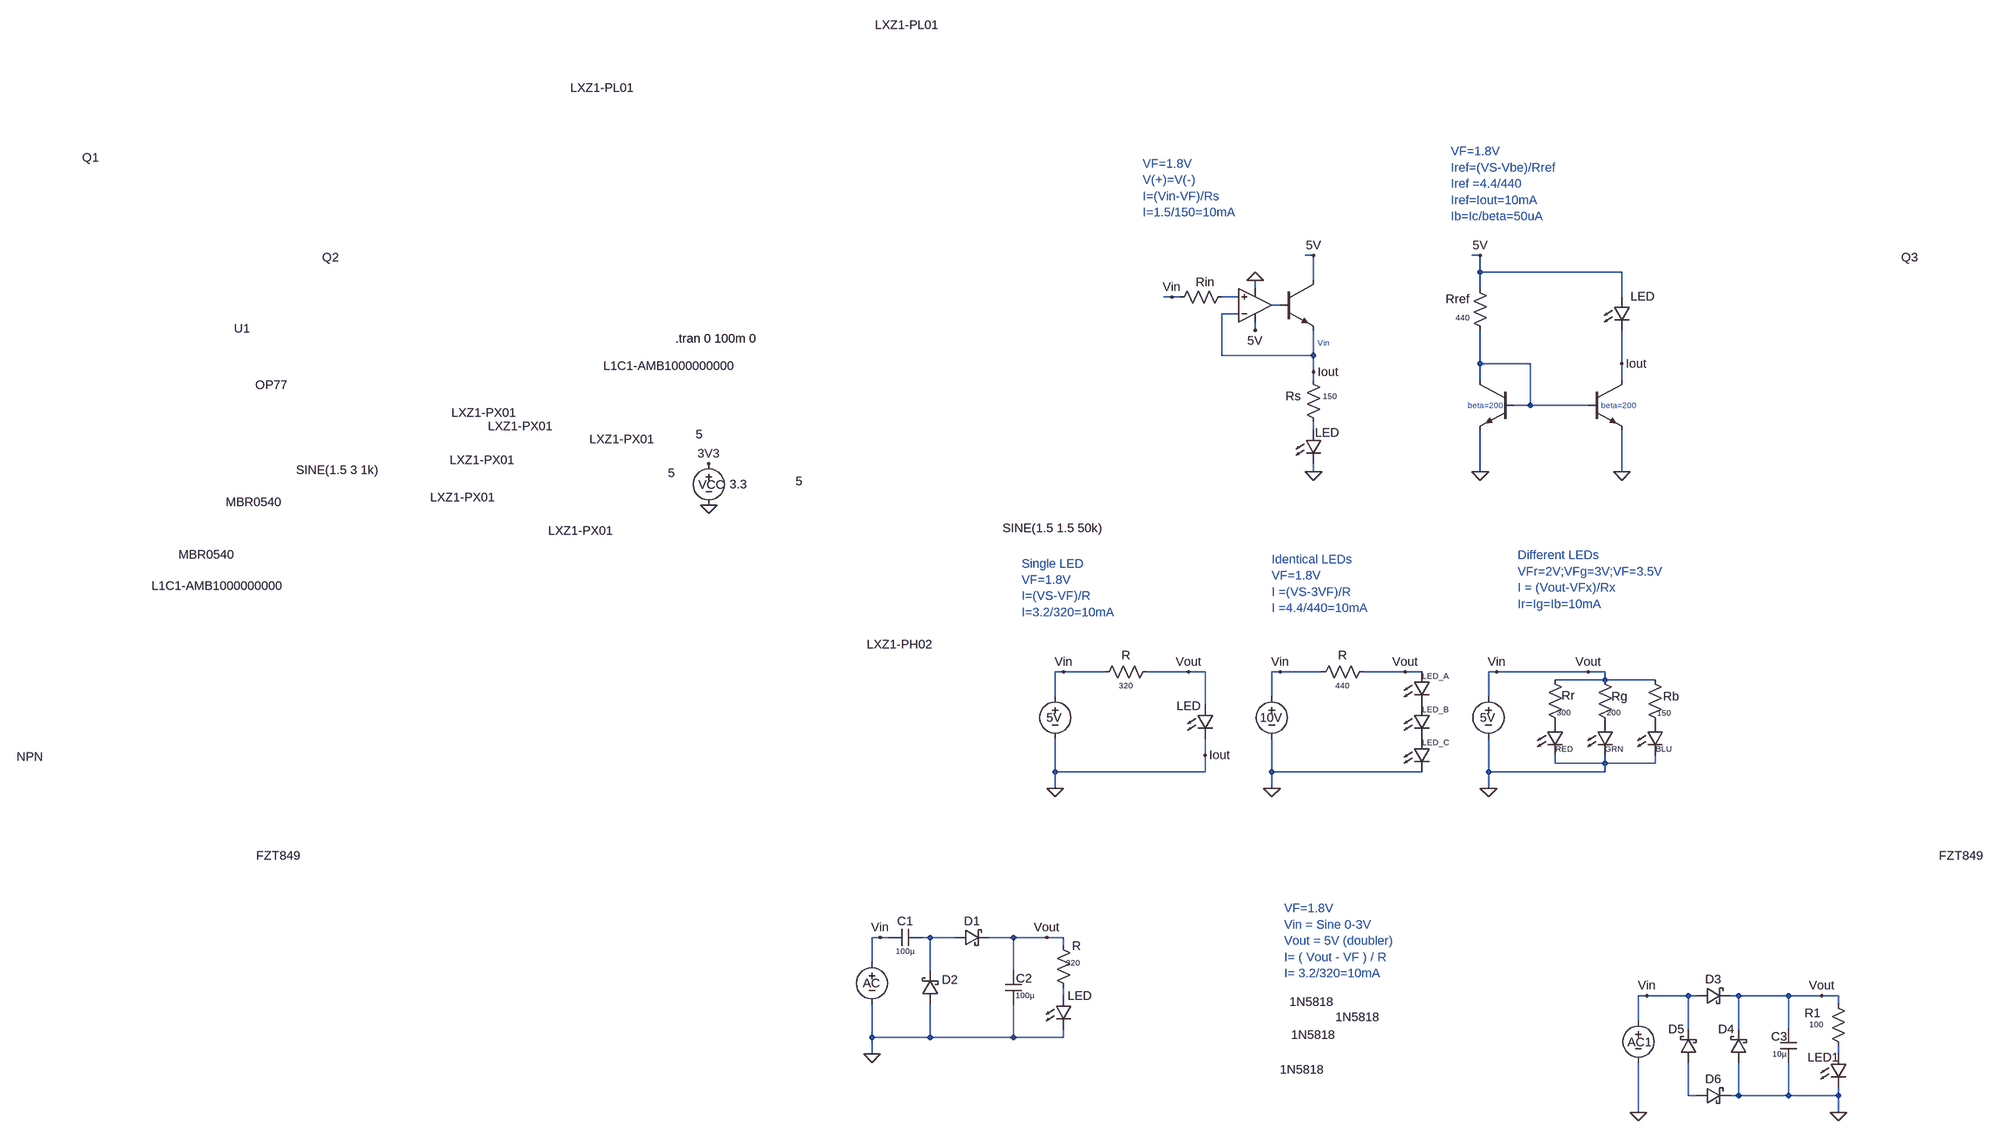
[diagram p0: schematic Resistor Driver.asc]
Resistor Driver.asc, the LTspice schematic file:
Version 4
SHEET 1 3604 1540
WIRE 544 -544 528 -544
WIRE 864 -544 848 -544
WIRE 864 -512 864 -544
WIRE 1136 -512 864 -512
WIRE 544 -496 544 -544
WIRE 432 -480 432 -496
WIRE 864 -480 864 -512
WIRE 272 -464 256 -464
WIRE 288 -464 272 -464
WIRE 400 -464 368 -464
WIRE 1136 -464 1136 -512
WIRE 480 -448 464 -448
WIRE 400 -432 368 -432
WIRE 432 -400 432 -416
WIRE 368 -352 368 -432
WIRE 544 -352 544 -400
WIRE 544 -352 368 -352
WIRE 864 -336 864 -400
WIRE 960 -336 864 -336
WIRE 1136 -336 1136 -400
WIRE 544 -320 544 -352
WIRE 544 -304 544 -320
WIRE 864 -304 864 -336
WIRE 1136 -304 1136 -336
WIRE 960 -256 960 -336
WIRE 960 -256 928 -256
WIRE 1072 -256 960 -256
WIRE 544 -208 544 -224
WIRE 544 -128 544 -144
WIRE 864 -128 864 -208
WIRE 1136 -128 1136 -208
WIRE 64 256 48 256
WIRE 144 256 64 256
WIRE 304 256 224 256
WIRE 336 256 304 256
WIRE 480 256 464 256
WIRE 560 256 480 256
WIRE 720 256 640 256
WIRE 752 256 720 256
WIRE 896 256 880 256
WIRE 1072 256 896 256
WIRE 1104 256 1072 256
WIRE 1104 272 1104 256
WIRE 1104 272 1008 272
WIRE 1200 272 1104 272
WIRE 48 304 48 256
WIRE 464 304 464 256
WIRE 880 304 880 256
WIRE 336 320 336 256
WIRE 336 416 336 384
WIRE 1008 432 1008 416
WIRE 1104 432 1104 416
WIRE 1104 432 1008 432
WIRE 1200 432 1200 416
WIRE 1200 432 1104 432
WIRE 48 448 48 384
WIRE 336 448 336 416
WIRE 336 448 48 448
WIRE 464 448 464 384
WIRE 752 448 464 448
WIRE 880 448 880 384
WIRE 1104 448 1104 432
WIRE 1104 448 880 448
WIRE 48 480 48 448
WIRE 464 480 464 448
WIRE 880 480 880 448
WIRE -288 768 -304 768
WIRE -272 768 -288 768
WIRE -192 768 -208 768
WIRE -144 768 -192 768
WIRE -32 768 -80 768
WIRE 32 768 -32 768
WIRE 64 768 32 768
WIRE 64 784 64 768
WIRE -304 816 -304 768
WIRE -192 832 -192 768
WIRE -32 832 -32 768
WIRE 64 880 64 864
WIRE 1184 880 1168 880
WIRE 1264 880 1184 880
WIRE 1280 880 1264 880
WIRE 1360 880 1344 880
WIRE 1456 880 1360 880
WIRE 1520 880 1456 880
WIRE 1552 880 1520 880
WIRE 1552 896 1552 880
WIRE 1168 928 1168 880
WIRE 1264 944 1264 880
WIRE 1360 944 1360 880
WIRE 1456 944 1456 880
WIRE -304 960 -304 896
WIRE -192 960 -192 896
WIRE -192 960 -304 960
WIRE -32 960 -32 896
WIRE -32 960 -192 960
WIRE 64 960 64 944
WIRE 64 960 -32 960
WIRE -304 992 -304 960
WIRE 1552 992 1552 976
WIRE 1264 1072 1264 1008
WIRE 1280 1072 1264 1072
WIRE 1360 1072 1360 1008
WIRE 1360 1072 1344 1072
WIRE 1456 1072 1456 1008
WIRE 1456 1072 1360 1072
WIRE 1552 1072 1552 1056
WIRE 1552 1072 1456 1072
WIRE 1168 1104 1168 1008
WIRE 1552 1104 1552 1072
FLAG 304 256 Vout
FLAG -624 -144 3V3
FLAG -624 -64 0
FLAG 48 480 0
FLAG 64 256 Vin
FLAG 720 256 Vout
FLAG 464 480 0
FLAG 480 256 Vin
FLAG 1072 256 Vout
FLAG 880 480 0
FLAG 896 256 Vin
FLAG 32 768 Vout
FLAG -304 992 0
FLAG -288 768 Vin
FLAG 432 -496 0
FLAG 272 -464 Vin
FLAG 544 -128 0
FLAG 544 -544 5V
FLAG 544 -320 Iout
FLAG 432 -400 5V
FLAG 1136 -128 0
FLAG 864 -544 5V
FLAG 1136 -336 Iout
FLAG 336 416 Iout
FLAG 864 -128 0
FLAG 1520 880 Vout
FLAG 1168 1104 0
FLAG 1184 880 Vin
FLAG 1552 1104 0
SYMBOL voltage 48 288 R0
WINDOW 123 0 0 Left 0
WINDOW 39 0 0 Left 0
WINDOW 0 -17 56 Left 2
WINDOW 3 -505 -398 Left 2
SYMATTR InstName 5V
SYMATTR Value 5
SYMBOL voltage -624 -160 R0
WINDOW 0 -20 57 Left 2
WINDOW 3 40 56 Left 2
WINDOW 123 0 0 Left 0
WINDOW 39 0 0 Left 0
SYMATTR InstName VCC
SYMATTR Value 3.3
SYMBOL res 240 240 R90
WINDOW 0 0 56 VBottom 2
WINDOW 3 32 56 VTop 1
SYMATTR InstName R
SYMATTR Value 320
SYMBOL LED 320 320 R0
WINDOW 0 -39 2 Left 2
WINDOW 3 -1146 -652 Left 2
SYMATTR InstName LED
SYMATTR Value L1C1-AMB1000000000
SYMBOL voltage 464 288 R0
WINDOW 123 0 0 Left 0
WINDOW 39 0 0 Left 0
WINDOW 0 -23 56 Left 2
WINDOW 3 -1113 -488 Left 2
SYMATTR InstName 10V
SYMATTR Value 5
SYMBOL res 656 240 R90
WINDOW 0 0 56 VBottom 2
WINDOW 3 32 56 VTop 1
SYMATTR InstName R
SYMATTR Value 440
SYMBOL LED 736 384 R0
WINDOW 0 17 8 Left 1
WINDOW 3 -1589 -575 Left 2
SYMATTR InstName LED_C
SYMATTR Value LXZ1-PX01
SYMBOL LED 736 256 R0
WINDOW 0 17 8 Left 1
WINDOW 3 -1784 -472 Left 2
SYMATTR InstName LED_A
SYMATTR Value LXZ1-PX01
SYMBOL LED 736 320 R0
WINDOW 0 17 8 Left 1
WINDOW 3 -1668 -335 Left 2
SYMATTR InstName LED_B
SYMATTR Value LXZ1-PX01
SYMBOL voltage 880 288 R0
WINDOW 123 0 0 Left 0
WINDOW 39 0 0 Left 0
WINDOW 0 -16 56 Left 2
WINDOW 3 -1582 -414 Left 2
SYMATTR InstName 5V
SYMATTR Value 5
SYMBOL LED 1184 352 R0
WINDOW 0 17 52 Left 1
WINDOW 3 -2305 -503 Left 2
SYMATTR InstName BLU
SYMATTR Value LXZ1-PX01
SYMBOL LED 992 352 R0
WINDOW 0 17 52 Left 1
WINDOW 3 -2110 -594 Left 2
SYMATTR InstName RED
SYMATTR Value LXZ1-PX01
SYMBOL LED 1088 352 R0
WINDOW 0 16 52 Left 1
WINDOW 3 -2247 -431 Left 2
SYMATTR InstName GRN
SYMATTR Value LXZ1-PX01
SYMBOL res 1120 368 R180
WINDOW 0 4 65 Right 2
WINDOW 3 -14 34 Left 1
SYMATTR InstName Rg
SYMATTR Value 200
SYMBOL res 1216 368 R180
WINDOW 0 -30 65 Left 2
WINDOW 3 -15 33 Left 1
SYMATTR InstName Rb
SYMATTR Value 150
SYMBOL res 1024 368 R180
WINDOW 0 4 66 Right 2
WINDOW 3 -14 34 Left 1
SYMATTR InstName Rr
SYMATTR Value 300
SYMBOL voltage -304 800 R0
WINDOW 123 0 0 Left 0
WINDOW 39 0 0 Left 0
WINDOW 0 -17 56 Left 2
WINDOW 3 -1221 -932 Left 2
SYMATTR InstName AC
SYMATTR Value SINE(1.5 3 1k)
SYMBOL cap -208 752 R90
WINDOW 0 0 32 VBottom 2
WINDOW 3 32 32 VTop 1
SYMATTR InstName C1
SYMATTR Value 100µ
SYMBOL schottky -144 784 R270
WINDOW 0 32 32 VTop 2
WINDOW 3 769 -1553 VBottom 2
SYMATTR InstName D1
SYMATTR Value MBR0540
SYMATTR Description Diode
SYMATTR Type diode
SYMBOL schottky -176 896 R180
WINDOW 0 -37 47 Left 2
WINDOW 3 1376 966 Left 2
SYMATTR InstName D2
SYMATTR Value MBR0540
SYMATTR Description Diode
SYMATTR Type diode
SYMBOL cap -48 832 R0
WINDOW 0 21 15 Left 2
WINDOW 3 20 47 Left 1
SYMATTR InstName C2
SYMATTR Value 100µ
SYMBOL res 48 768 R0
WINDOW 0 32 16 Left 2
WINDOW 3 21 49 Left 1
SYMATTR InstName R
SYMATTR Value 320
SYMBOL LED 48 880 R0
WINDOW 3 -1850 -789 Left 2
SYMATTR InstName LED
SYMATTR Value L1C1-AMB1000000000
SYMBOL OpAmps\\OP77 432 -384 M180
WINDOW 0 -2076 19 Left 2
WINDOW 3 -2035 -89 Left 2
SYMATTR InstName U1
SYMBOL res 384 -480 R90
WINDOW 0 3 48 VBottom 2
WINDOW 3 31 55 VTop 2
SYMATTR InstName Rin
SYMATTR Value ""
SYMBOL npn 480 -496 R0
WINDOW 0 -2547 -236 Left 2
WINDOW 3 -2673 915 Left 2
SYMATTR InstName Q1
SYMBOL res 528 -320 R0
WINDOW 0 -8 47 Right 2
WINDOW 3 34 47 Left 1
SYMATTR InstName Rs
SYMATTR Value 150
SYMBOL LED 528 -208 R0
WINDOW 0 19 5 Left 2
WINDOW 3 -1418 -988 Left 2
SYMATTR InstName LED
SYMATTR Value LXZ1-PL01
SYMBOL res 880 -384 R180
WINDOW 0 36 76 Left 2
WINDOW 3 36 40 Left 1
SYMATTR InstName Rref
SYMATTR Value 440
SYMBOL npn 1072 -304 R0
WINDOW 0 -2547 -236 Left 2
WINDOW 3 -2673 915 Left 2
SYMATTR InstName Q2
SYMATTR Value FZT849
SYMBOL LED 1120 -464 R0
WINDOW 0 33 -1 Left 2
WINDOW 3 -1418 -988 Left 2
SYMATTR InstName LED
SYMATTR Value LXZ1-PL01
SYMBOL npn 928 -304 M0
WINDOW 0 -2547 -236 Left 2
WINDOW 3 -2673 915 Left 2
SYMATTR InstName Q3
SYMATTR Value FZT849
SYMBOL voltage 1168 912 R0
WINDOW 123 0 0 Left 0
WINDOW 39 0 0 Left 0
WINDOW 0 -21 57 Left 2
WINDOW 3 -1221 -932 Left 2
SYMATTR InstName AC1
SYMATTR Value SINE(1.5 1.5 50k)
SYMBOL schottky 1280 896 R270
WINDOW 0 32 32 VTop 2
WINDOW 3 20 -740 VBottom 2
SYMATTR InstName D3
SYMATTR Value 1N5818
SYMATTR Description Diode
SYMATTR Type diode
SYMBOL LED 1536 992 R0
WINDOW 0 -43 6 Left 2
WINDOW 3 -1850 -789 Left 2
SYMATTR InstName LED1
SYMATTR Value LXZ1-PH02
SYMBOL schottky 1376 1008 R180
WINDOW 0 24 64 Left 2
WINDOW 3 790 53 Left 2
SYMATTR InstName D4
SYMATTR Value 1N5818
SYMATTR Description Diode
SYMATTR Type diode
SYMBOL schottky 1280 1008 R180
WINDOW 0 24 64 Left 2
WINDOW 3 609 87 Left 2
SYMATTR InstName D5
SYMATTR Value 1N5818
SYMATTR Description Diode
SYMATTR Type diode
SYMBOL schottky 1280 1088 R270
WINDOW 0 32 32 VTop 2
WINDOW 3 82 -758 VBottom 2
SYMATTR InstName D6
SYMATTR Value 1N5818
SYMATTR Description Diode
SYMATTR Type diode
SYMBOL cap 1440 944 R0
WINDOW 0 -17 14 Left 2
WINDOW 3 -15 48 Left 1
SYMATTR InstName C3
SYMATTR Value 10µ
SYMBOL res 1568 992 R180
WINDOW 0 50 79 Left 2
WINDOW 3 45 57 Left 1
SYMATTR InstName R1
SYMATTR Value 100
TEXT -688 -384 Left 2 !.tran 0 100m 0
TEXT -16 48 Left 2 ;Single LED\nVF=1.8V\nI=(VS-VF)/R \nI=3.2/320=10mA
TEXT 464 40 Left 2 ;Identical LEDs\nVF=1.8V\nI =(VS-3VF)/R \nI =4.4/440=10mA
TEXT 936 32 Left 2 ;Different LEDs\nVFr=2V;VFg=3V;VF=3.5V\nI = (Vout-VFx)/Rx\nIr=Ig=Ib=10mA
TEXT 488 712 Left 2 ;VF=1.8V\nVin = Sine 0-3V\nVout = 5V (doubler)\nI= ( Vout - VF ) / R \nI= 3.2/320=10mA
TEXT 216 -720 Left 2 ;VF=1.8V\nV(+)=V(-)\nI=(Vin-VF)/Rs\nI=1.5/150=10mA
TEXT 552 -376 Left 1 ;Vin
TEXT 808 -744 Left 2 ;VF=1.8V\nIref=(VS-Vbe)/Rref\nIref =4.4/440\nIref=Iout=10mA\nIb=Ic/beta=50uA
TEXT 1096 -256 Left 1 ;beta=200
TEXT 840 -256 Left 1 ;beta=200

The netlist it stands for:
* Resistor Driver.asc
V§5V Vin 0 5
VCC 3V3 0 3.3
R Vin Vin 320
D§LED Vin 0 L1C1-AMB1000000000
V§10V Vin 0 5
R Vin Vin 440
D§LED_C P001 0 LXZ1-PX01
D§LED_A Vin P002 LXZ1-PX01
D§LED_B P002 P001 LXZ1-PX01
V§5V Vin 0 5
D§BLU P003 0 LXZ1-PX01
D§RED P004 0 LXZ1-PX01
D§GRN P005 0 LXZ1-PX01
Rg P005 Vin 200
Rb P003 Vin 150
Rr P004 Vin 300
V§AC Vin 0 SINE(1.5 3 1k)
C1 N005 Vin 100µ
D1 N005 Vin MBR0540
D2 0 N005 MBR0540
C2 Vin 0 100µ
R Vin N006 320
D§LED N006 0 L1C1-AMB1000000000
XU1 N001 0 5V 0 N002 OP77  ; pins In+ In- V+ V- OUT
Rin N001 Vin
Q1 5V N002 0 0 NPN
Rs 0 N004 150
D§LED N004 0 LXZ1-PL01
Rref N003 5V 440
Q2 0 N003 0 0 FZT849
D§LED 5V 0 LXZ1-PL01
Q3 N003 N003 0 0 FZT849
V§AC1 Vin 0 SINE(1.5 1.5 50k)
D3 Vin Vin 1N5818
D§LED1 N007 0 LXZ1-PH02
D4 0 Vin 1N5818
D5 N008 Vin 1N5818
D6 N008 0 1N5818
C3 Vin 0 10µ
R1 N007 Vin 100
.model D D
.lib standard.dio
.model NPN NPN
.model PNP PNP
.lib standard.bjt
.tran 0 100m 0
* Single LED
* VF=1.8V
* I=(VS-VF)/R
* I=3.2/320=10mA
* Identical LEDs
* VF=1.8V
* I =(VS-3VF)/R
* I =4.4/440=10mA
* Different LEDs
* VFr=2V;VFg=3V;VF=3.5V
* I = (Vout-VFx)/Rx
* Ir=Ig=Ib=10mA
* VF=1.8V
* Vin = Sine 0-3V
* Vout = 5V (doubler)
* I= ( Vout - VF ) / R
* I= 3.2/320=10mA
* VF=1.8V
* V(+)=V(-)
* I=(Vin-VF)/Rs
* I=1.5/150=10mA
* Vin
* VF=1.8V
* Iref=(VS-Vbe)/Rref
* Iref =4.4/440
* Iref=Iout=10mA
* Ib=Ic/beta=50uA
* beta=200
* beta=200
.lib ADI.lib
.backanno
.end